# Altium schematic sheet v1.0.SchDoc
size 127 x 38 mm
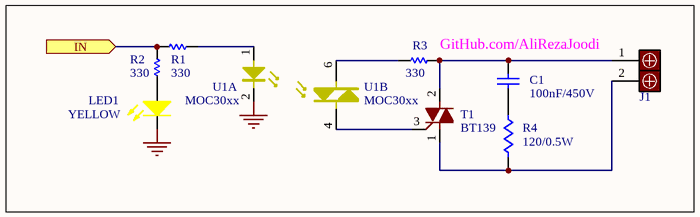
[diagram p0: v1.0.SchDoc]

## Parts
C1  100nF/450V  [CAPR7.62-6.8x5]
J1  2PIN  [Connector_Phoenix_2PIN_MSTB]  (value not drawn)
LED1  YELLOW  [LED_THD_3MM_YELLOW_R]
R1  330  [R_THD_AXIAL0.4(1/4W)]
R2  330  [R_THD_AXIAL0.4(1/4W)]
R3  330  [R_THD_AXIAL0.4(1/4W)]
R4  120/0.5W  [AXIAL-0.4]
T1  BT139  [TO220_3PIN_V]
U1  MOC30xx  [DIP_6]  (parts A,B of 2)

## Ports
IN (in)

## Nets
GND: LED1.2(K) U1.2(K)
IN: R1.1 R2.2 ; port IN
NetC1_1: C1.1 R4.2
NetC1_2: C1.2 J1.1 R3.2 T1.2(T2)
NetJ1_2: J1.2 R4.1 T1.1(T1)
NetLED1_1: LED1.1(A) R2.1
NetR1_2: R1.2 U1.1(A)
NetR3_1: R3.1 U1.6(A/K)
NetT1_3: T1.3(G) U1.4(A/K)

## Notes on the sheet
- GitHub.com/AliRezaJoodi

## Library data of the parts
C1 = Cap: Capacitor; Manufacturer: Generic Components; Class I: Passive; Published: 8-Jun-2000; Revision: July-2002: Re-released for DXP Platform.; Publisher: Altium Limited; Class II: Capacitor
J1 = Connector1x2_Power2: Connector, Header, 2Pin; Revision: July-2002: Re-released for DXP Platform.
LED1 = LED_YELLOW: LED, Yellow; Manufacturer: Generic Components; Class I: Optoelectronic; Published: 8-Jun-2000; Revision: July-2002: Re-released for DXP Platform.; Publisher: Altium Limited; Class II: LED
R1-R3 = Resistor: Revision: July-2002: Re-released for DXP Platform.
R4 = Res1: Resistor; Manufacturer: Generic Components; Class I: Passive; Published: 8-Jun-2000; Revision: July-2002: Re-released for DXP Platform.; Publisher: Altium Limited; Class II: Resistor
T1 = Triac: Triac,
U1 = MOC3021: Opto-Triac